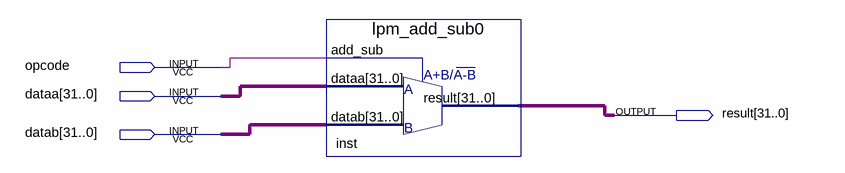
[diagram p0: schematic sheet]
// Quartus schematic ULA.bdf as structural Verilog: 1 symbols, 4 pins
module ULA (
  input  opcode,
  input  [31:0] dataa,
  input  [31:0] datab,
  output [31:0] result
);

  lpm_add_sub0 inst (.add_sub(opcode), .dataa(dataa), .datab(datab), .result(result));
endmodule
